# EAGLE design MoteinoMEGA (EAGLE 6.5.0)
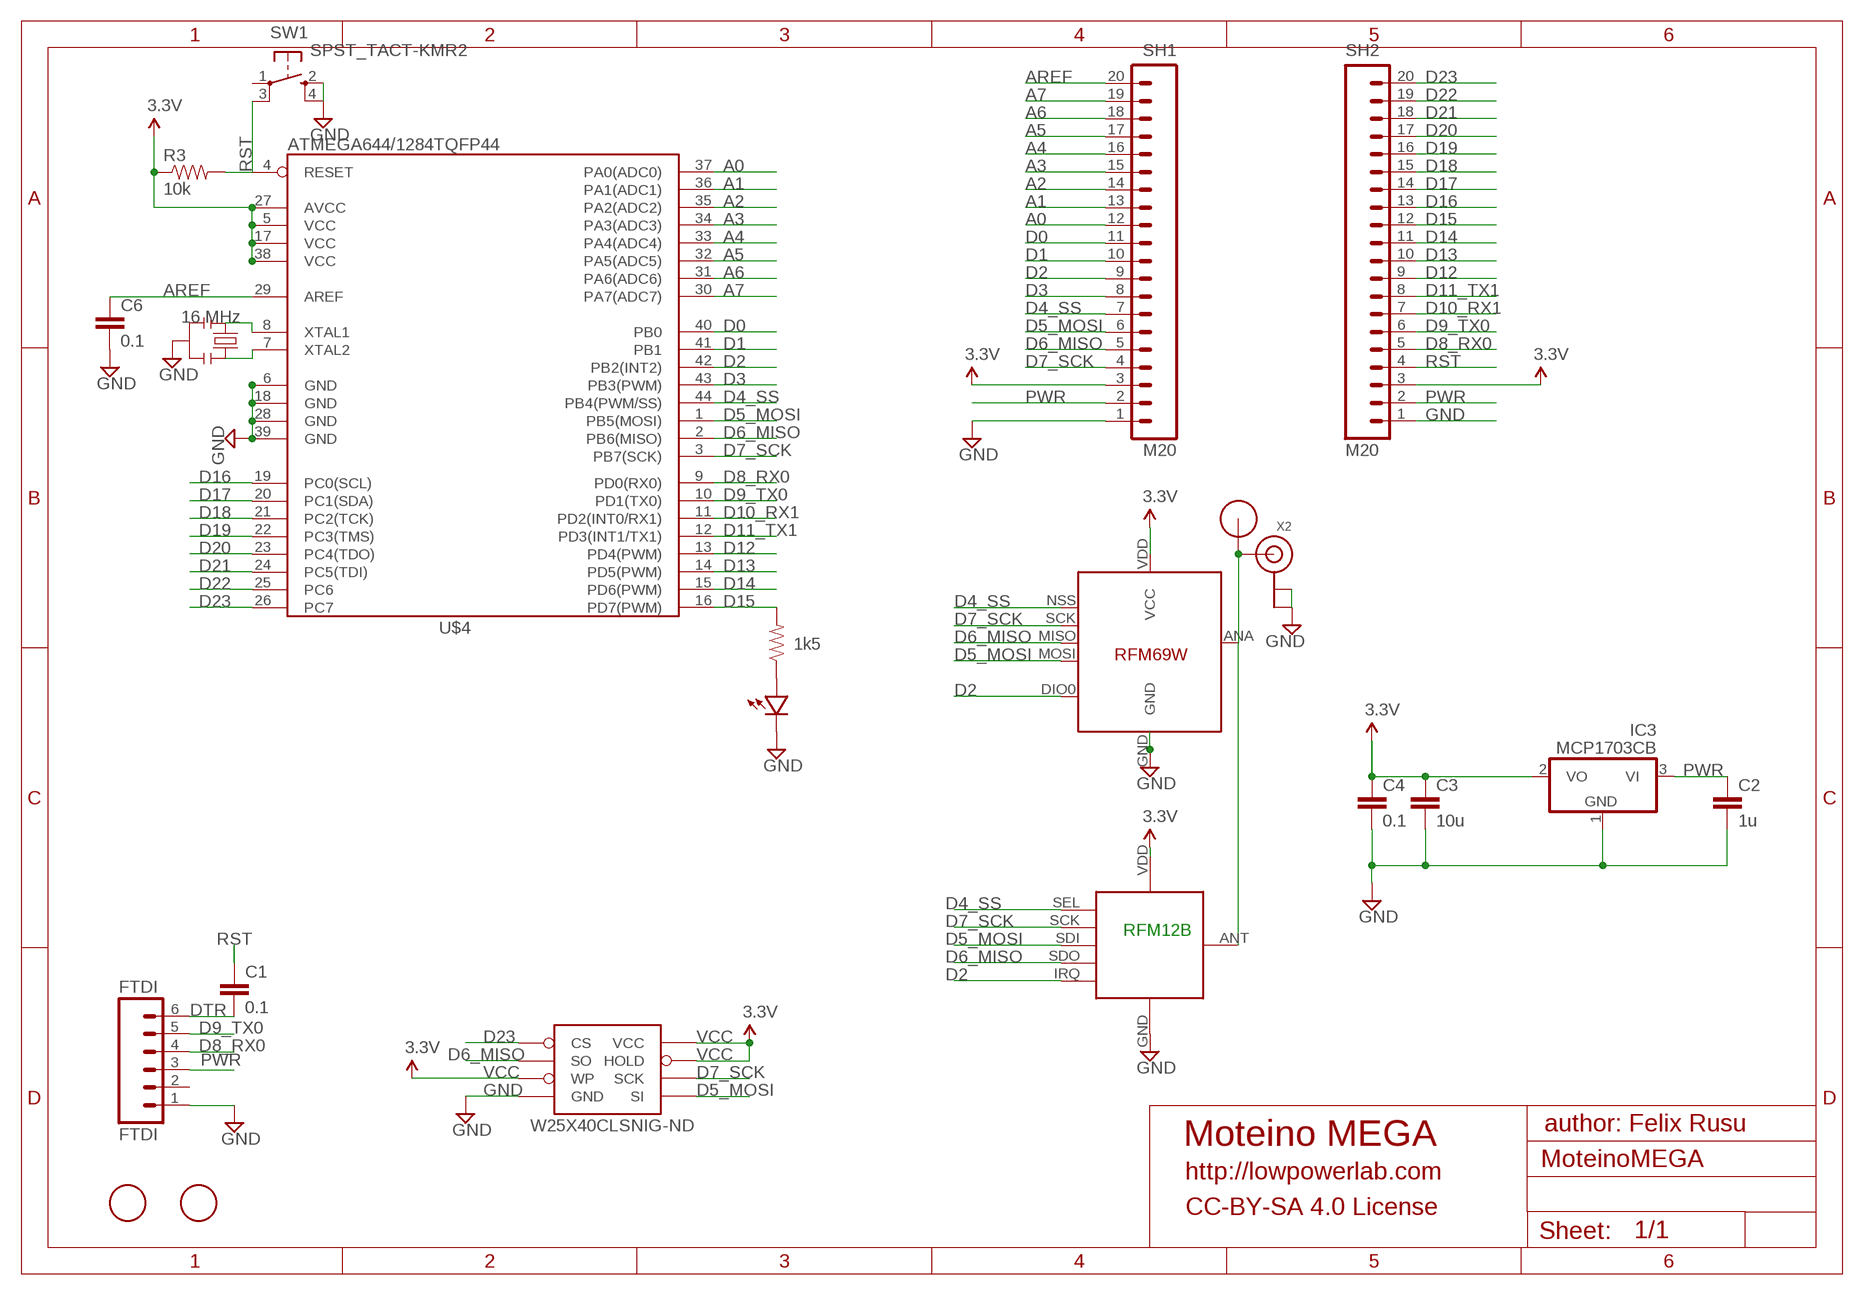
[diagram p0: schematic, sheet 1]

## Parts
C1  0.1  CAP0603-CAP  [0603-CAP]
C2  1u  CAP0603-CAP  [0603-CAP]
C3  10u  CAP0805-CAP  [0805-CAP]
C4  0.1  CAP0603-CAP  [0603-CAP]
C6  0.1  CAP0603-CAP  [0603-CAP]
FTDI  FTDI  M06SIP  [1X06]
IC3  MCP1703CB  [SOT23]
R2  1k5  RESISTOR0603-RES  [0603-RES]
R3  10k  RESISTOR0603-RES  [0603-RES]
RFM12B  RFM12B_MINPADS  [RFM12B-MINPADS]
SH1  M20  [1X20]
SH2  M20  [1X20]
SW1  SPST_TACT-KMR2  [KMR2]
U$1  RFM12B_ANTENNA  [RFM12B-ANTENNA]
U$2  FIDUCIAL  [FIDUCIAL_1MM]
U$4  ATMEGA644/1284TQFP44  [TQFP44]
U$5  RFM69  [RFM69W-MINPADS]
U$6  LED0603  [0603-LED]
U$7  FIDUCIAL  [FIDUCIAL_1MM]
W25X40CLSNIG-ND  AT25F512BWIDE_5.3MM  [SO08WIDE]
X1  16 MHz  RESONATORSMD  [RESONATOR-SMD]
X2  ANTENNA_U.FL  [U.FL]

## Nets
A0: SH1.12 U$4.37(PA0(ADC0))
A1: SH1.13 U$4.36(PA1(ADC1))
A2: SH1.14 U$4.35(PA2(ADC2))
A3: SH1.15 U$4.34(PA3(ADC3))
A4: SH1.16 U$4.33(PA4(ADC4))
A5: SH1.17 U$4.32(PA5(ADC5))
A6: SH1.18 U$4.31(PA6(ADC6))
A7: SH1.19 U$4.30(PA7(ADC7))
AREF: C6.1 SH1.20 U$4.29(AREF)
D0: SH1.11 U$4.40(PB0)
D1: SH1.10 U$4.41(PB1)
D2: RFM12B.IRQ SH1.9 U$4.42(PB2(INT2)) U$5.DIO0
D3: SH1.8 U$4.43(PB3(PWM))
D4_SS: RFM12B.SEL SH1.7 U$4.44(PB4(PWM/SS)) U$5.NSS(SEL)
D5_MOSI: RFM12B.SDI(SDI/MOSI) SH1.6 U$4.1(PB5(MOSI)) U$5.MOSI W25X40CLSNIG-ND.5(SI)
D6_MISO: RFM12B.SDO(SDO/MISO) SH1.5 U$4.2(PB6(MISO)) U$5.MISO W25X40CLSNIG-ND.2(SO)
D7_SCK: RFM12B.SCK SH1.4 U$4.3(PB7(SCK)) U$5.SCK W25X40CLSNIG-ND.6(SCK)
D8_RX0: FTDI.4 SH2.5 U$4.9(PD0(RX0))
D9_TX0: FTDI.5 SH2.6 U$4.10(PD1(TX0))
D10_RX1: SH2.7 U$4.11(PD2(INT0/RX1))
D11_TX1: SH2.8 U$4.12(PD3(INT1/TX1))
D12: SH2.9 U$4.13(PD4(PWM))
D13: SH2.10 U$4.14(PD5(PWM))
D14: SH2.11 U$4.15(PD6(PWM))
D15: R2.2 SH2.12 U$4.16(PD7(PWM))
D16: SH2.13 U$4.19(PC0(SCL))
D17: SH2.14 U$4.20(PC1(SDA))
D18: SH2.15 U$4.21(PC2(TCK))
D19: SH2.16 U$4.22(PC3(TMS))
D20: SH2.17 U$4.23(PC4(TDO))
D21: SH2.18 U$4.24(PC5(TDI))
D22: SH2.19 U$4.25(PC6)
D23: SH2.20 U$4.26(PC7) W25X40CLSNIG-ND.1(CS)
DTR: C1.2 FTDI.6
GND [power]: C2.2 C3.2 C4.2 C6.2 FTDI.1 IC3.1(GND) RFM12B.GND SH1.1 SH2.1 SW1.2(S) SW1.4(S1) U$4.6(GND) U$4.18(GND) U$4.28(GND) U$4.39(GND) U$5.GND U$6.MINUS W25X40CLSNIG-ND.4(GND) X1.2 X2.1(GND) X2.2(GND)
N$1: U$4.8(XTAL1) X1.1
N$2: R2.1 U$6.PLUS
N$3: RFM12B.ANT U$1.P$1 U$5.ANA(ANT) X2.3(SIGNAL)
N$4: U$4.7(XTAL2) X1.3
PWR [power]: C2.1 FTDI.3 IC3.3(VI) SH1.2 SH2.2
RST: C1.1 R3.2 SH2.4 SW1.3(P1) U$4.4(RESET)
VCC: C3.1 C4.1 IC3.2(VO) R3.1 RFM12B.VDD SH1.3 SH2.3 U$4.5(VCC) U$4.17(VCC) U$4.27(AVCC) U$4.38(VCC) U$5.VDD(VCC) W25X40CLSNIG-ND.3(WP) W25X40CLSNIG-ND.7(HOLD) W25X40CLSNIG-ND.8(VCC) ; supply symbol labelled 3.3V
Unconnected: FTDI.2 SW1.1(P)

## Notes on the sheet
- RFM12B
- author: Felix Rusu
- Moteino MEGA
- http://lowpowerlab.com
- CC-BY-SA 4.0 License

## Library data of the parts
C1-C4 C6 = LowPowerLab:CAP: Capacitor Standard 0603 ceramic capacitor, and 0.1" leaded capacitor.
FTDI = SparkFun-Connectors:M06: Header 6 Standard 6-pin 0.1" header. Use with straight break away headers (SKU : PRT-00116), right angle break away headers (PRT-00553), swiss pins (PRT-00743), machine pins (PRT-00117), and female headers (PRT-00115). Molex polarized connector foot print use with SKU : PRT-08094 with associated crimp pins and housings. NOTES ON THE VARIANTS LOCK and LOCK_LONGPADS... This footprint was designed to help hold the alignment of a through-hole component (i.e. 6-pin header) while soldering it into place. You may notice that each hole has been shifted either up or down by 0.005 of an inch from it's more standard position (which is a perfectly straight line). This slight alteration caused the pins (the squares in the middle) to touch the edges of the holes. Because they are alternating, it causes a "brace" to hold the component in place. 0.005 has proven to be the perfect amount of "off-center" position when using our standard breakaway headers. Although looks a little odd when you look at the bare footprint, once you have a header in there, the alteration is very hard to notice. Also, if you push a header all the way into place, it is covered up entirely on the bottom side. This idea of altering the position of holes to aid alignment will be further integrated into the Sparkfun Library for other footprints. It can help hold any component with 3 or more connection pins.
IC3 = linear:MCP1703: 250 mA, 16V, Low Quiescent Current LDO Regulator Source: http://ww1.microchip.com/downloads/en/DeviceDoc/22049b.pdf
R2 R3 = LowPowerLab:RESISTOR: Resistor Basic schematic elements and footprints for 0603, 1206, and PTH resistors.
RFM12B = LowPowerLab:RFM12B_MINPADS
SH1 SH2 = SparkFun-Connectors:M20: 1x20 .1" header This is just like the LOCK variant in that the holes are staggared by 5 mil, but except for the last two holes. They are not altered from the "standard" footprint layout. This is used for a special purpose on the layout of our Graphic LCD Backpack. Make sure you want to use this device before selecting it for you project!
SW1 = adafruit:SPST_TACT: SMT 6mm switch, EVQQ2 series http://www.ladyada.net/library/eagle
U$1 = LowPowerLab:RFM12B_ANTENNA
U$2 U$7 = adafruit:FIDUCIAL: For use by pick and place machines to calibrate the vision/machine, 1mm By microbuilder.eu
U$4 = LowPowerLab:ATMEGA644/1284
U$5 = LowPowerLab:RFM69
U$6 = LowPowerLab:LED
W25X40CLSNIG-ND = LowPowerLab:AT25F512B: 4-Mbit SPI flash memory
X1 = SparkFun:RESONATOR: Resonator Small SMD resonator. This is the itty bitty 10/20MHz resonators with built in caps. CSTCE10M0G55 and CSTCE20M0V53. Footprint has been reviewed closely but hasn't been tested yet.
X2 = adafruit:ANTENNA_U.FL: U.FL Antenna Connector

## Net classes
1 power: width 0.381 mm, clearance 0.254 mm

## Board
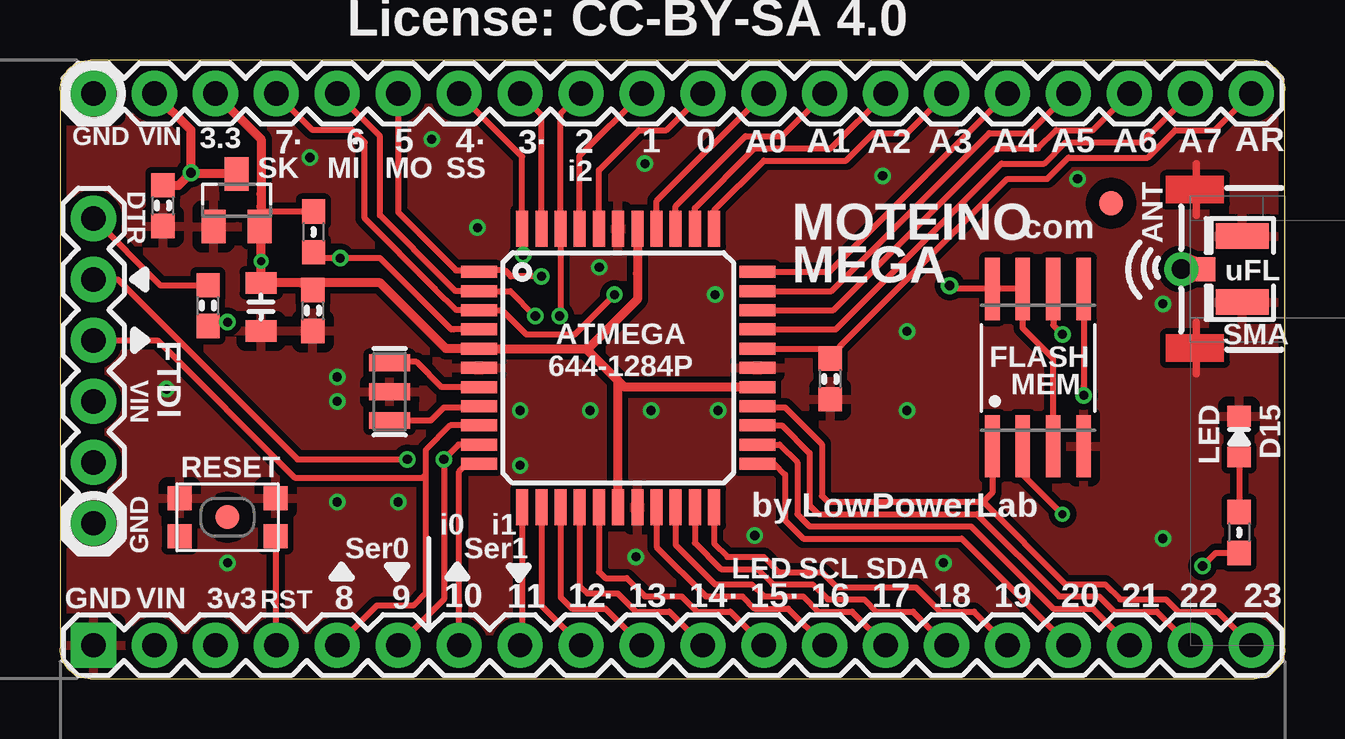
[diagram p1: board, top side]
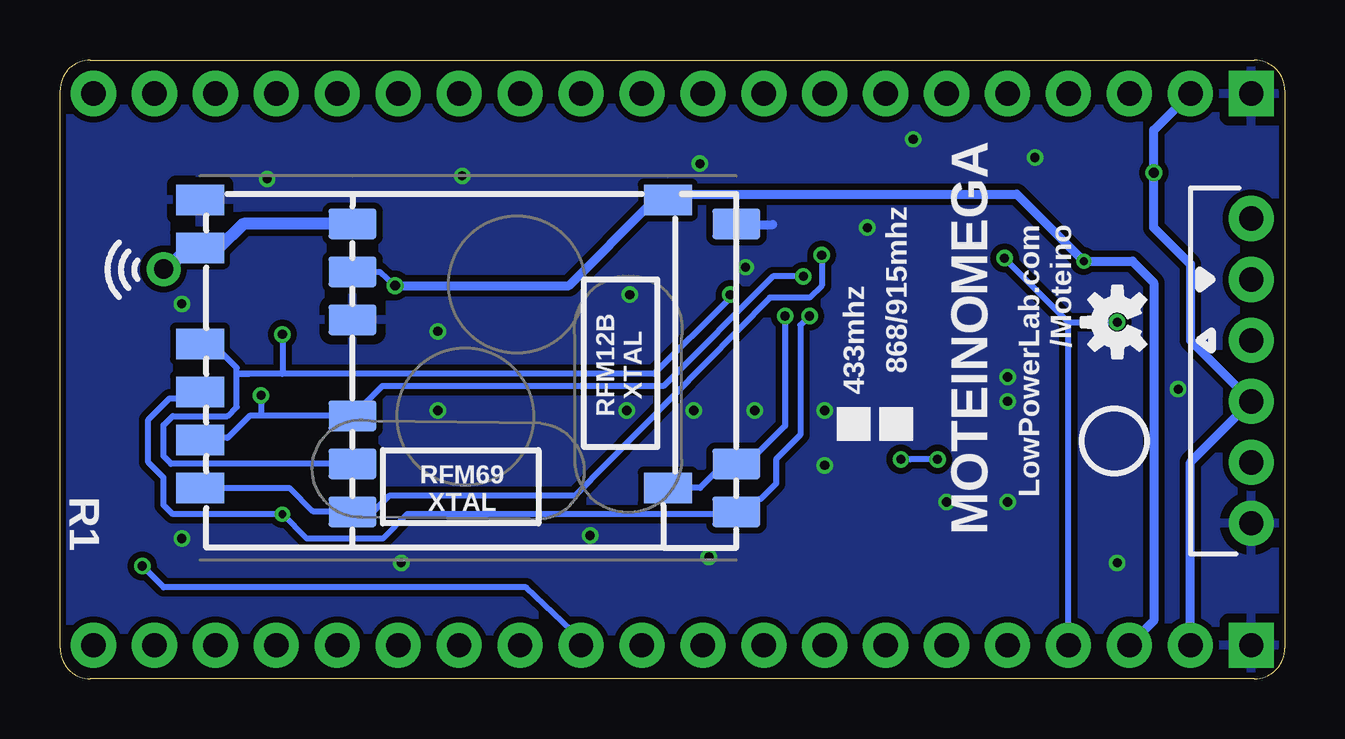
[diagram p2: board, bottom side, seen from below]

Size 51.05 x 25.78 mm. Coordinates in mm from the lower left corner, seen from the top.
Outline: 1.27,0 49.78,0 arc90 51.05,1.27 51.05,24.51 arc90 49.78,25.78 1.27,25.78 arc90 0,24.51 0,1.27 arc90 1.27,0
Copper layers (1*16): Top 0.035mm / dielectric 1.5mm / Bottom 0.035mm
Design rules "ITEADstudio_DRC *": minimum track width 6mil, minimum drill 12mil, track to track 6mil, track to pad 6mil, pad to pad 6mil, via to via 6mil, smd to smd 0mil, copper to edge 10mil, drill to drill 10mil, minimum pad ring 10mil, minimum via ring 6mil, stop-mask expansion 2mil, vias tented up to drill 100mil, thermal gap 15mil
tRestrict: area 42.4,8.3 to 42.9,8.4
bRestrict: area 38.2,14.2 to 40,15.2; area 37.6,14.1 to 38.1,14.7; area 37.5,15.2 to 38,15.8; area 43.9,20.1 to 44.5,20.8; area 43.9,19.1 to 44.5,19.8; area 44.9,20.3 to 45.4,20.9; area 45.6,19.4 to 46.3,20.6

### Footprints (pad centres in the part's own frame; a part is rotated, then mirrored left to right if it is on the bottom)
0603-CAP = smd 1.016 x 0.965: 1 -0.85,0; 2 0.85,0
0805-CAP = smd 0.902 x 1.3: 1 -1,0; 2 1,0
1X06 = drill 1.016 pad 1.88: 1 0,0; 2 2.54,0; 3 5.08,0; 4 7.62,0; 5 10.16,0; 6 12.7,0
SOT23 = smd 1 x 1.4: 1 -0.95,-1.1; 2 0.95,-1.1; 3 0,1.1
0603-RES = smd 1.016 x 0.965: 1 -0.85,0; 2 0.85,0
RFM12B-MINPADS = smd 2 x 1.27: ANT 8,-6; GND 8,-2; IRQ -8,4; SCK 8,4; SDI 8,2; SDI1 -8.002,-6.001; SDO -8,6; SEL 8,6; VDD 8,-4
1X20 = drill 1.016 pad 1.88 square: 1 0,0 | drill 1.016 pad 1.88: 2 2.54,0; 3 5.08,0; 4 7.62,0; 5 10.16,0; 6 12.7,0; 7 15.24,0; 8 17.78,0; 9 20.32,0; 10 22.86,0; 11 25.4,0; 12 27.94,0; 13 30.48,0; 14 33.02,0; 15 35.56,0; 16 38.1,0; 17 40.64,0; 18 43.18,0; 19 45.72,0; 20 48.26,0
KMR2 = smd 1 x 1: 1 2,0.8; 2 2,-0.8; 3 -2,0.8; 4 -2,-0.8
RFM12B-ANTENNA = drill 0.8 pad 1.422: P$1 0,0
FIDUCIAL_1MM = smd 1 x 1: 1 0,0
TQFP44 = smd 1.5 x 0.5: 1 -5.8,4; 2 -5.8,3.2; 3 -5.8,2.4; 4 -5.8,1.6; 5 -5.8,0.8; 6 -5.8,0; 7 -5.8,-0.8; 8 -5.8,-1.6; 9 -5.8,-2.4; 10 -5.8,-3.2; 11 -5.8,-4; 23 5.8,-4; 24 5.8,-3.2; 25 5.8,-2.4; 26 5.8,-1.6; 27 5.8,-0.8; 28 5.8,0; 29 5.8,0.8; 30 5.8,1.6; 31 5.8,2.4; 32 5.8,3.2; 33 5.8,4 | smd 0.5 x 1.5: 12 -4,-5.8; 13 -3.2,-5.8; 14 -2.4,-5.8; 15 -1.6,-5.8; 16 -0.8,-5.8; 17 0,-5.8; 18 0.8,-5.8; 19 1.6,-5.8; 20 2.4,-5.8; 21 3.2,-5.8; 22 4,-5.8; 34 4,5.8; 35 3.2,5.8; 36 2.4,5.8; 37 1.6,5.8; 38 0.8,5.8; 39 0,5.8; 40 -0.8,5.8; 41 -1.6,5.8; 42 -2.4,5.8; 43 -3.2,5.8; 44 -4,5.8
RFM69W-MINPADS = smd 2 x 1.27: ANA 8,-5; DIO0 -11.5,5; GND 8,-7; MISO 8,1; MOSI 8,3; NSS 8,5; SCK 8,-1; VDD -11.5,-7
0603-LED = smd 0.864 x 0.965: MINUS -0.85,0; PLUS 0.85,0
SO08WIDE = smd 0.61 x 2.6: 1 -1.905,-3.269; 2 -0.635,-3.269; 3 0.635,-3.269; 4 1.905,-3.269; 5 1.905,3.286; 6 0.635,3.286; 7 -0.635,3.286; 8 -1.905,3.286
RESONATOR-SMD = smd 0.7 x 1.7: 1 -1.2,0; 2 0,0; 3 1.2,0
U.FL = smd 2.2 x 1.05: 1 0,1.375; 2 0,-1.375 | smd 0.8 x 1: 3 1.525,0

### Placement (x,y rotation side)
C1  6.17,15.54 90 top
C2  4.29,19.71 270 top
C3  8.38,15.49 270 top
C4  10.54,15.34 270 top
C6  32.11,12.5 270 top
FTDI  1.4,6.48 90 top
IC3  7.37,19.94 0 top
R2  49.15,6.1 270 top
R3  10.57,18.62 270 top
RFM12B  30.86,12.95 180 bottom
SH1  1.4,24.38 0 top
SH2  1.4,1.4 0 top
SW1  6.99,6.73 180 top
U$1  46.74,17.07 0 top
U$2  6.99,6.73 0 top
U$3  [OSHW-LOGO-S]  6.99,14.86 90 bottom
U$4  23.27,12.95 0 top
U$5  37.21,12.95 180 bottom
U$6  49.15,10.08 270 top
U$7  43.81,19.81 0 top
W25X40CLSNIG-ND  40.77,12.95 0 top
X1  13.74,11.96 90 top
X2  49.28,17.07 180 top

### Tracks (layer width: path | path; a pad name or v marks a point on that pad's centre or on a via)
A0
  Top 0.254: U$4.37 24.87,19.91 SH1.12
A1
  Top 0.254: U$4.36 25.67,19.7 28.57,22.61 30.1,22.61 SH1.13
A2
  Top 0.254: U$4.35 26.47,19.61 28.96,22.1 32.13,22.1 SH1.14
A3
  Top 0.254: U$4.34 27.27,19.52 29.34,21.59 32.77,21.59 33.91,22.73 35.31,22.73 SH1.15
A4
  Top 0.254: U$4.33 32.07,16.95 SH1.16
A5
  Top 0.254: U$4.32 32.16,16.15 38.73,22.73 40.39,22.73 SH1.17
A6
  Top 0.254: U$4.31 32.24,15.35 38.99,22.1 40.77,22.1 41.53,22.86 43.05,22.86 SH1.18
A7
  Top 0.254: U$4.30 32.33,14.55 39.24,21.46 41.02,21.46 41.91,22.35 45.09,22.35 SH1.19
AREF
  Top 0.254: U$4.29 32.42,13.75 32.58,13.91 | 32.58,13.91 39.5,20.83 41.15,20.83 42.04,21.72 45.34,21.72 46.48,22.86 48.13,22.86 SH1.20 | C6.1 32.23,13.49 32.58,13.91
D0
  Top 0.254: U$4.40 22.47,21.2 24.13,22.86 25.27,22.86 SH1.11
D1
  Top 0.254: U$4.41 21.67,21.79 SH1.10
D2  (via drill 0.38)
  Top 0.254: SH1.9 20.87,23.53 U$4.42 20.87,15.33 v20.83,15.11
  Bottom 0.254: 22.86,9.02 23.31,9.02 | 23.31,9.02 RFM12B.IRQ 22.8,9.02 22.35,9.02 20.83,10.54 v20.83,15.11 | 23.31,9.02 24.37,7.95 U$5.DIO0
D3
  Top 0.254: U$4.43 20.07,23.5 SH1.8
D4_SS  (via drill 0.38)
  Top 0.254: SH1.7 19.27,21.75 U$4.44 19.27,17.44 v19.3,17.65
  Bottom 0.254: U$5.NSS 41.48,7.95 40.51,6.99 39.4,6.99 RFM12B.SEL 39.34,6.99 37.97,6.99 37.34,7.62 29.59,7.62 21.46,15.88 19.81,15.88 19.3,16.38 v19.3,17.65
D5_MOSI  (via drill 0.38)
  Top 0.254: W25X40CLSNIG-ND.5 42.67,12.19 v42.67,11.81 | SH1.6 14.1,19.43 16.51,17.02 17.4,17.02 U$4.1 17.53,17.02 18.54,17.02 18.8,16.76 v20.07,16.76
  Bottom 0.254: 43.15,10.95 RFM12B.SDI 37.62,12.19 25.91,12.19 21.34,16.76 v20.07,16.76 | 43.15,10.95 44.07,10.03 45.64,10.03 U$5.MOSI | v42.67,11.81 42.67,10.99 43.15,10.95
D6_MISO  (via drill 0.33, 0.38)
  Top 0.254: SH1.5 13.34,22.61 13.34,19.3 16.13,16.51 16.48,16.15 U$4.2 18.77,16.15 v19.81,15.11 | W25X40CLSNIG-ND.2 40.13,8.51 v41.78,6.86
  Bottom 0.254: RFM12B.SDO 23.34,6.99 22.99,6.99 | U$5.MISO 45.86,11.68 46.48,11.68 47.37,10.79 47.37,9.02 46.74,8.38 46.74,7.24 46.35,6.86 v41.78,6.86 40.77,5.84 37.59,5.84 36.58,6.86 23.5,6.86 23.4,6.95 RFM12B.SDO | v19.81,15.11 20.19,14.73 20.19,10.16 21.21,9.14 21.21,8.13 21.84,7.49 22.35,7.37 22.64,6.95 RFM12B.SDO
D7_SCK  (via drill 0.38)
  Top 0.254: SH1.4 10.54,22.86 12.19,22.86 12.7,22.35 12.7,19.18 15.62,16.26 16.52,15.35 U$4.3 18.43,15.35 19.43,14.35 21.46,14.35 v23.11,16 | W25X40CLSNIG-ND.6 41.4,14.73 v41.78,14.35
  Bottom 0.254: RFM12B.SCK 46.42,8.95 46.74,9.27 46.74,10.57 46.35,10.95 44.07,10.95 43.69,11.33 43.69,12.7 | v23.11,16 23.24,15.75 26.29,12.7 41.78,12.7 | 41.78,12.7 43.18,12.7 | 43.18,12.7 43.69,12.7 | 43.69,12.7 43.18,12.7 | 43.18,12.7 43.69,12.7 | v41.78,14.35 41.78,12.7 | 43.69,12.7 43.69,12.95 44.7,13.97 45.2,13.97 U$5.SCK
D8_RX0
  Top 0.254: U$4.9 16.27,10.55 15.24,9.53 15.24,8.51 | 15.24,8.51 15.24,3.56 14.73,3.05 13.21,3.05 SH2.5 | FTDI.4 4.06,14.1 9.78,8.38 15.11,8.38 15.24,8.51
D9_TX0  (via drill 0.38)
  Top 0.254: U$4.10 16.61,9.75 v16,9.14 16,9.02 16,3.3 SH2.6 | FTDI.5 2.41,16.64 9.91,9.14 v14.48,9.14
  Bottom 0.254: v14.48,9.14 15.62,9.14 v16,9.14
D10_RX1
  Top 0.254: SH2.7 16.64,8.64 16.89,8.89 17.4,8.89 U$4.11
D11_TX1
  Top 0.254: U$4.12 19.27,1.49 SH2.8
D12
  Top 0.254: U$4.13 20.07,3.05 SH2.9
D13
  Top 0.254: U$4.14 20.87,3.39 21.34,2.92 22.73,2.92 SH2.10
D14
  Top 0.254: U$4.15 21.67,3.86 21.97,3.56 23.24,3.56 24,2.79 25.4,2.79 SH2.11
D15  (via drill 0.38)
  Top 0.254: U$4.16 22.47,4.46 22.73,4.19 23.62,4.19 24.38,3.43 25.91,3.43 26.54,2.79 27.94,2.79 SH2.12 | v47.62,4.7 48.17,5.25 R2.2
  Bottom 0.254: SH2.12 29.34,1.65 31.62,3.81 46.74,3.81 v47.62,4.7
D16
  Top 0.254: U$4.19 24.87,5.49 26.92,3.43 28.45,3.43 28.96,2.92 30.35,2.92 SH2.13
D17
  Top 0.254: U$4.20 25.67,5.58 27.3,3.94 28.83,3.94 29.34,3.43 30.99,3.43 31.62,2.79 33.02,2.79 SH2.14
D18
  Top 0.254: U$4.21 26.47,5.67 27.56,4.57 29.08,4.57 29.72,3.94 31.37,3.94 32,3.3 33.53,3.3 34.04,2.79 35.56,2.79 SH2.15
D19
  Top 0.254: U$4.22 27.27,5.63 27.81,5.08 29.34,5.08 29.97,4.45 31.75,4.45 32.38,3.81 35.69,3.81 36.7,2.79 38.1,2.79 SH2.16
D20
  Top 0.254: U$4.23 29.78,8.95 30.23,8.51 30.23,6.6 30.99,5.84 37.59,5.84 SH2.17
D21
  Top 0.254: U$4.24 30,9.75 30.73,9.02 30.73,6.86 31.24,6.35 37.97,6.35 41.4,2.92 43.05,2.92 SH2.18
D22
  Top 0.254: U$4.25 30.09,10.55 31.24,9.4 31.24,7.24 31.62,6.86 38.23,6.86 41.66,3.43 43.31,3.43 43.94,2.79 45.72,2.79 SH2.19
D23
  Top 0.254: U$4.26 29.12,11.3 30.23,11.3 31.75,9.78 31.75,7.62 32,7.37 38.48,7.37 | 38.48,7.37 41.91,3.94 43.56,3.94 44.2,3.3 46.1,3.3 46.61,2.79 48.26,2.79 SH2.20 | W25X40CLSNIG-ND.1 38.86,7.75 38.48,7.37
DTR
  Top 0.254: FTDI.6 4.18,16.39 C1.2
GND  (via drill 0.38)
  Top 0.305: 47.37,12.7 47.37,14.86 | 47.37,19.3 47.37,21.46
  Bottom 0.381: 22.48,18.92 21.34,18.92
  other vias: 24.38,21.46 11.56,12.57 27.3,16 24.64,11.18 15.49,22.48 35.31,14.48 34.29,20.95 27.43,11.18 10.41,21.72 19.18,8.89 24,5.08 28.96,5.97 42.42,20.83 22.48,17.14 11.56,7.37 6.99,4.83 14.1,7.37 19.18,11.18 11.56,11.56 36.83,4.83 45.97,5.84 45.97,15.62 22.1,11.18 35.31,11.18 17.4,18.8 4.45,12.06
  pour Bottom: -0.51,26.16 -0.64,-0.76 51.82,-0.76 51.82,26.16
  pour Top: -0.51,26.16 -0.64,-0.76 51.82,-0.76 51.82,26.16
N$1
  Top 0.254: X1.1 15.46,10.76 16,11.3 17.41,11.3 U$4.8
N$2
  Top 0.254: U$6.PLUS R2.1
N$3
  Top 0.508: X2.3 U$1.P$1
  Bottom 0.254: 45.72,17.96 U$5.ANA
  Bottom 0.508: RFM12B.ANT 43.4,18.95 44.45,17.91 45.67,17.91 U$5.ANA | 45.72,17.96 46.61,17.07 U$1.P$1
N$4
  Top 0.254: U$4.7 15.91,12.15 14.86,13.21 13.79,13.21 X1.3
N$5
  Top 0.254: 46.91,17.63 47.62,17.32 47.62,16.84 47.57,16.79 46.89,16.51
PWR  (via drill 0.41)
  Top 0.381: IC3.3 5.5,21.04 v5.46,21.08 | v5.46,21.08 5.46,22.86 SH1.2 | C2.1 4.94,20.56 v5.46,21.08
  Bottom 0.381: SH2.2 3.94,9.02 FTDI.3 3.94,14.1 3.94,17.27 5.46,18.8 v5.46,21.08 5.46,22.86 SH1.2
RST  (via drill 0.38)
  Top 0.254: U$4.4 16.42,14.55 16.31,14.55 13.34,17.53 v11.68,17.53 10.3,17.53 R3.2 | C1.1 5.88,14.86 6.73,14.86 v6.99,14.86 | SW1.3 8.98,1.43 SH2.4
  Bottom 0.254: SH2.4 9.02,14.86 | v11.68,17.53 9.02,14.86 | 9.02,14.86 v6.99,14.86
VCC  (via drill 0.33, 0.41)
  Top 0.254: v37.08,16.38 37.23,16.24 W25X40CLSNIG-ND.8 W25X40CLSNIG-ND.7 40.13,14.61 41.4,13.34 W25X40CLSNIG-ND.3 | 8.5,18.4 8.38,18.29 | 8.38,18.77 IC3.2 8.44,19.47 R3.1 | C4.1 10.16,16.37 10.03,16.49
  Top 0.381: 21.97,13.72 21.93,13.75 U$4.5 16.09,13.75 13.35,16.49 10.03,16.49 C3.1 v8.38,17.4 8.38,18.29 8.38,18.77 | 21.97,13.72 23.24,12.45 | 23.24,12.45 23.24,7.18 U$4.17 | U$4.38 24.07,16.89 24.07,15.81 21.97,13.72 | U$4.27 23.53,12.15 23.24,12.45 | SH1.3 8.38,22.48 8.38,20.19 8.38,19.68 8.38,18.91 IC3.2
  Bottom 0.254: RFM12B.VDD 37.72,16.95 v37.08,16.38
  Bottom 0.381: SH2.3 5.46,2.41 5.46,16.51 6.35,17.4 v8.38,17.4 11.18,20.19 25.4,20.19 25.64,19.95 25.77,19.95 U$5.VDD 26.36,19.81 26.42,19.81 29.84,16.38 v37.08,16.38
(copper drawn outside any net)
  shapes: Top area x2

### Text on the board
tPlace: License: CC-BY-SA 4.0 | ANT | MOTEINO | .com | MEGA | uFL | SMA | by LowPowerLab
bPlace: 868/915mhz | LowPowerLab.com / /Moteino | MEGA | 433mhz | RFM12B / XTAL | R1 | RFM69 / XTAL | MOTEINO
tDocu: REG
_tsilk: VIN | 3.3 | 7 | . | . | 6 | 5 | 4 | . | 3 | . | 2 | 1 | 0 | A1 | A2 | A3 | A4 | A5 | A6 | A7 | GND | A0 | AR | SK | MI | MO | SS | i2 | DTR | ATMEGA / 644-1284P | FLASH | VIN | MEM | FTDI | LED | D15 | RESET | GND | Ser0 | i0 | i1 | Ser1 | VIN | 3v3 | RST | 8 | 9 | 10 | 11 | 12 | . | 13 | . | 14 | LED | . | 15 | SCL | . | 16 | SDA | 17 | 18 | 19 | 20 | 21 | 22 | 23 | GND
_bsilk: VIN | 3.3 | 7 | 6 | 5 | 4 | 3 | 2 | 1 | 0 | A1 | A2 | A3 | A4 | A5 | A6 | A7 | GND | A0 | AR | ~ | ~ | ~ | ~ | i2 | use with: | DTR | RFM69CW | ANT | RFM69W/HW | RFM12B | VIN | CC | FTDI (Ser0) | GND | RX0 | RX1 | i0 | i1 | VIN | 3v3 | RST | 8 | 9 | TX0 | 10 | 11 | TX1 | 12 | ~ | 13 | ~ | 14 | ~ | 15 | ~ | 16 | 17 | 18 | 19 | 20 | 21 | 22 | 23 | GND